# EAGLE schematic multiprise (EAGLE 5.06)
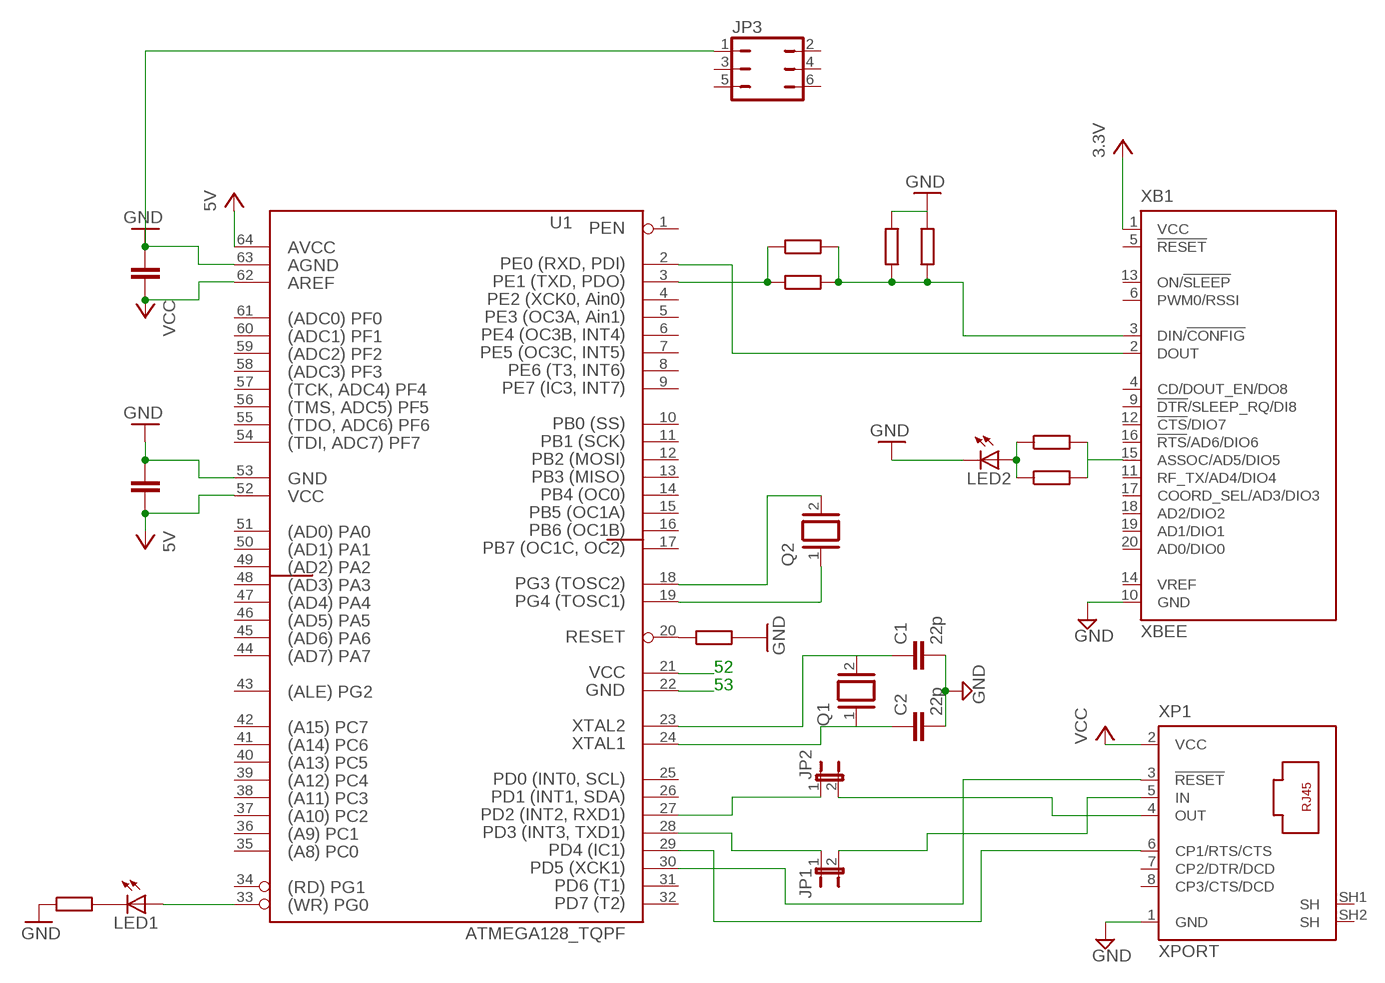
[diagram p0: schematic, sheet 1]

## Parts
C1  22p  C2,5-3  [C2.5-3]
C2  22p  C2,5-3  [C2.5-3]
JP1  JP1E  [JP1]
JP2  JP1E  [JP1]
JP3  JP3Q  [JP3Q]
LED1  LED  [SMARTLED-TTW]
LED2  LED  [SMARTLED-TTW]
Q1  XTAL  [Q]
Q2  XTAL  [Q]
U1  ATMEGA128_TQPF  [TQFP64]
XB1  XBEE  [XBEE]
XP1  XPORT  [XPORT]

## Nets
GND: C1.2 C2.2 JP3.1 LED2.C@1(C) U1.53 U1.63 XB1.10(GND) XP1.1(GND)
N$1: JP2.2 XP1.4(OUT)
N$3: JP2.1 U1.27
N$4: JP1.1 U1.28
N$5: C1.1 Q1.2 U1.23
N$6: C2.1 Q1.1 U1.24
N$7: U1.21
N$8: U1.22
N$9: Q2.2 U1.18
N$10: Q2.1 U1.19
N$11: U1.30 XP1.3(!RESET)
N$12: U1.29 XP1.6(CP1/RTS/CTS)
N$13: LED1.A@1(A) U1.33
N$14: U1.3
N$15: XB1.3(DIN/!CONFIG)
N$16: U1.2 XB1.2(DOUT)
N$17: XB1.15(ASSOC/AD5/DIO5)
N$18: LED2.A@1(A)
N$19: JP1.2 XP1.5(IN)
VCC: U1.52 U1.62 U1.64 XB1.1(VCC) XP1.2(VCC) ; supply symbol labelled 3.3V, 5V
Unconnected: JP3.2 JP3.3 JP3.4 JP3.5 JP3.6 LED1.C@1(C) U1.1 U1.4 U1.5 U1.6 U1.7 U1.8 U1.9 U1.10 U1.11 U1.12 U1.13 U1.14 U1.15 U1.16 U1.17 U1.20 U1.25 U1.26 U1.31 U1.32 U1.34 U1.35 U1.36 U1.37 U1.38 U1.39 U1.40 U1.41 U1.42 U1.43 U1.44 U1.45 U1.46 U1.47 U1.48 U1.49 U1.50 U1.51 U1.54 U1.55 U1.56 U1.57 U1.58 U1.59 U1.60 U1.61 XB1.4(CD/DOUT_EN/DO8) XB1.5(!RESET) XB1.6(PWM0/RSSI) XB1.9(!DTR!/SLEEP_RQ/DI8) XB1.11(RF_TX/AD4/DIO4) XB1.12(!CTS!/DIO7) XB1.13(ON/!SLEEP) XB1.14(VREF) XB1.16(!RTS!/AD6/DIO6) XB1.17(COORD_SEL/AD3/DIO3) XB1.18(AD2/DIO2) XB1.19(AD1/DIO1) XB1.20(AD0/DIO0) XP1.7(CP2/DTR/DCD) XP1.8(CP3/CTS/DCD) XP1.SH1(SH) XP1.SH2(SH)

## Notes on the sheet
- 52
- 53

## Library data of the parts
C1 C2 = capacitor-wima:C: CAPACITOR naming: grid - package width
JP1 JP2 = jumper:JP1E: JUMPER
JP3 = jumper:JP3Q: JUMPER
LED1 LED2 = led:LED: LED OSRAM: - CHIPLED LG R971, LG N971, LY N971, LG Q971, LY Q971, LO R971, LY R971 LH N974, LH R974 LS Q976, LO Q976, LY Q976 LO Q996 - Hyper CHIPLED LW Q18S LB Q993, LB Q99A, LB R99A - SideLED LS A670, LO A670, LY A670, LG A670, LP A670 LB A673, LV A673, LT A673, LW A673 LH A674 LY A675 LS A676, LA A676, LO A676, LY A676, LW A676 LS A679, LY A679, LG A679 - Hyper Micro SIDELED® LS Y876, LA Y876, LO Y876, LY Y876 LT Y87S - SmartLED LW L88C, LW L88S LB L89C, LB L89S, LG L890 LS L89K, LO L89K, LY L89K LS L896, LA L896, LO L896, LY L896 - TOPLED LS T670, LO T670, LY T670, LG T670, LP T670 LSG T670, LSP T670, LSY T670, LOP T670, LYG T670 LG T671, LOG T671, LSG T671 LB T673, LV T673, LT T673, LW T673 LH T674 LS T676, LA T676, LO T676, LY T676, LB T676, LH T676, LSB T676, LW T676 LB T67C, LV T67C, LT T67C, LS T67K, LO T67K, LY T67K, LW E67C LS E67B, LA E67B, LO E67B, LY E67B, LB E67C, LV E67C, LT E67C LW T67C LS T679, LY T679, LG T679 LS T770, LO T770, LY T770, LG T770, LP T770 LB T773, LV T773, LT T773, LW T773 LH T774 LS E675, LA E675, LY E675, LS T675 LS T776, LA T776, LO T776, LY T776, LB T776 LHGB T686 LT T68C, LB T68C - Hyper Mini TOPLED® LB M676 - Mini TOPLED Santana® LG M470 LS M47K, LO M47K, LY M47K Source: http://www.osram.convergy.de LUXEON: - LUMILED® LXK2-PW12-R00, LXK2-PW12-S00, LXK2-PW14-U00, LXK2-PW14-V00 LXK2-PM12-R00, LXK2-PM12-S00, LXK2-PM14-U00 LXK2-PE12-Q00, LXK2-PE12-R00, LXK2-PE12-S00, LXK2-PE14-T00, LXK2-PE14-U00 LXK2-PB12-K00, LXK2-PB12-L00, LXK2-PB12-M00, LXK2-PB14-N00, LXK2-PB14-P00, LXK2-PB14-Q00 LXK2-PR12-L00, LXK2-PR12-M00, LXK2-PR14-Q00, LXK2-PR14-R00 LXK2-PD12-Q00, LXK2-PD12-R00, LXK2-PD12-S00 LXK2-PH12-R00, LXK2-PH12-S00 LXK2-PL12-P00, LXK2-PL12-Q00, LXK2-PL12-R00 Source: www.luxeon.com KINGBRIGHT: KA-3528ASYC Source: www.kingbright.com
Q1 Q2 = special:XTAL: CRYSTAL
U1 = Atmel_Prototype_Header:ATMEGA128: MICROCONTROLLER 128 Kbytes FLASH 4 Kbytes SRAM 4 Kbytes EEPROM DUAL USART 8-channel 10 bit ADC
XB1 = maxstream:XBEE: XBee (TM) /XBee-PRO(TM) OEM RF Modules Source: MaxStream, Inc. xbee_productmanual.pdf
XP1 = lantronix:XPORT: Serial to 10/100 Ethernet transceiver Source: http://www.lantronix.com/pdf/XPort_DS.pdf